# Altium schematic sheet mechanical.SchDoc: SigJumper-Bottom - Mechanical
size Letter; CheckedBy: J. Brinton; CompanyName: Signal Laboratories, Inc.; DrawnBy: J. Brinton; Engineer: J. Brinton; Address1: 3479 Edison Way; Address2: Menlo Park CA 94025; Address3: +1 (877) 778-8435; Address4: siglabs.com; Revision: 2; SheetNumber: 3; SheetTotal: 4
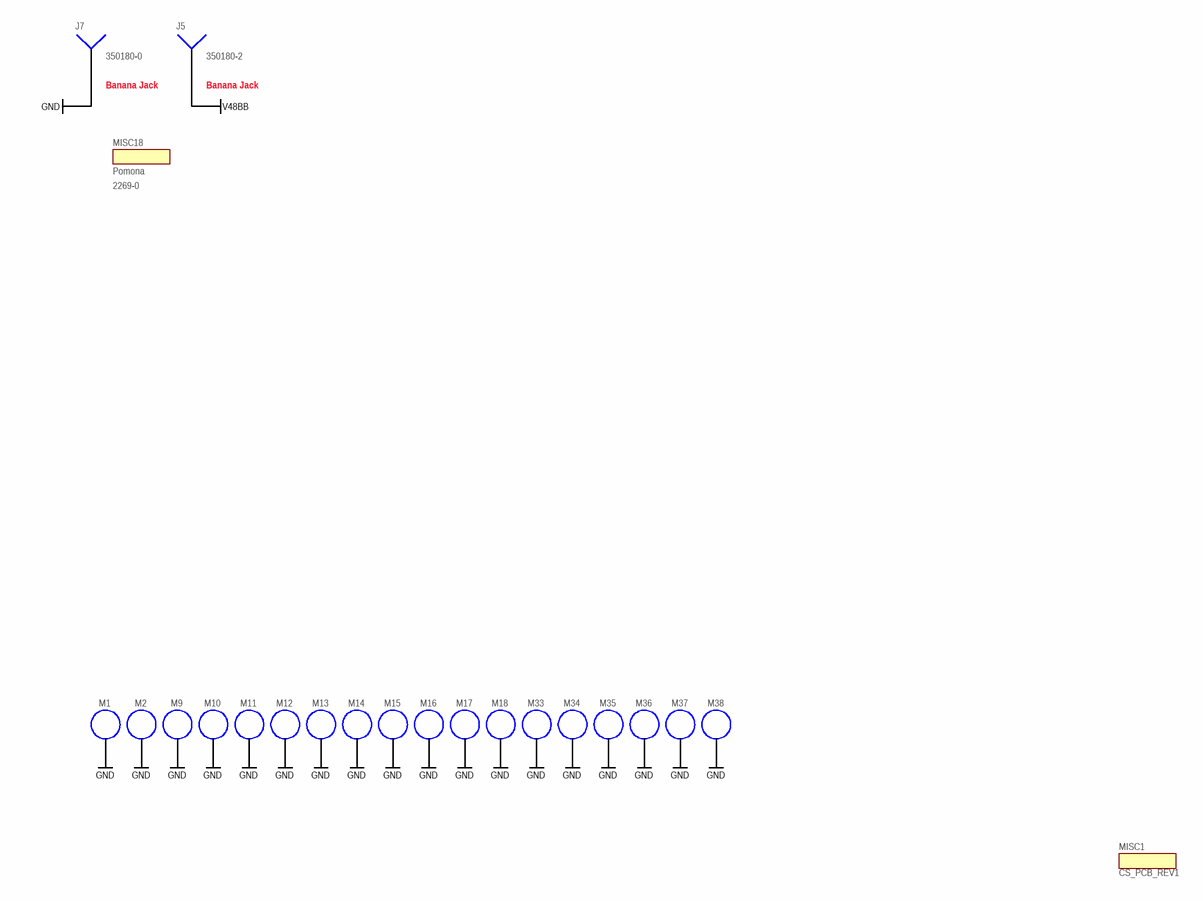
[diagram p0: mechanical.SchDoc]

## Parts
J5  350180-2  [POWER_PAD]  (no BOM)
J7  350180-0  [POWER_PAD]  (no BOM)
M1  MOUNT  [MOUNTM3]  (value not drawn)  (no BOM)
M2  MOUNT  [MOUNTM3]  (value not drawn)  (no BOM)
M9  MOUNT  [MOUNTM3]  (value not drawn)  (no BOM)
M10  MOUNT  [MOUNTM3]  (value not drawn)  (no BOM)
M11  MOUNT  [MOUNTM3]  (value not drawn)  (no BOM)
M12  MOUNT  [MOUNTM3]  (value not drawn)  (no BOM)
M13  MOUNT  [MOUNTM3]  (value not drawn)  (no BOM)
M14  MOUNT  [MOUNTM3]  (value not drawn)  (no BOM)
M15  MOUNT  [MOUNTM3]  (value not drawn)  (no BOM)
M16  MOUNT  [MOUNTM3]  (value not drawn)  (no BOM)
M17  MOUNT  [MOUNTM3]  (value not drawn)  (no BOM)
M18  MOUNT  [MOUNTM3]  (value not drawn)  (no BOM)
M33  MOUNT  [MOUNTM3]  (value not drawn)  (no BOM)
M34  MOUNT  [MOUNTM3]  (value not drawn)  (no BOM)
M35  MOUNT  [MOUNTM3]  (value not drawn)  (no BOM)
M36  MOUNT  [MOUNTM3]  (value not drawn)  (no BOM)
M37  MOUNT  [MOUNTM3]  (value not drawn)  (no BOM)
M38  MOUNT  [MOUNTM3]  (value not drawn)  (no BOM)
MISC1  CS_PCB_REV1  (mechanical)
MISC18  2269-0  Manufacturer: Pomona  (mechanical)

## Nets
GND: J7.1 M1.1(MNT) M2.1(MNT) M9.1(MNT) M10.1(MNT) M11.1(MNT) M12.1(MNT) M13.1(MNT) M14.1(MNT) M15.1(MNT) M16.1(MNT) M17.1(MNT) M18.1(MNT) M33.1(MNT) M34.1(MNT) M35.1(MNT) M36.1(MNT) M37.1(MNT) M38.1(MNT)
V48BB: J5.1

## Notes on the sheet
- Banana Jack
- (near J5) Banana Jack
- Title
- Engineer
- Revision
- Drawn By
- Checked By
- Date
- Sheet
- of

## Library data of the parts
J5 = Socket: Test Probe Assembly; Red; Manufacturer: TE Connectivity; Manufacturer P/N: 350180-2
J7 = Socket: Test Probe Assembly; Black; Manufacturer: TE Connectivity; Manufacturer P/N: 350180-0
M1 M2 M9-M18 M33-M38 = MOUNT: M3 Standard Fit Hole; Manufacturer: *; Manufacturer P/N: *
MISC1 = M50-1900005: Copper Suicide PCB; Manufacturer: Signal Laboratories, Inc.; Manufacturer P/N: CS_PCB_REV1
MISC18 = M50-1900005: Double Banana Jack Connector; Do Not Place: PURCHASE BUT DNP; Manufacturer P/N: 2269-0